# EAGLE design kbd2snes (EAGLE 6.6.0)
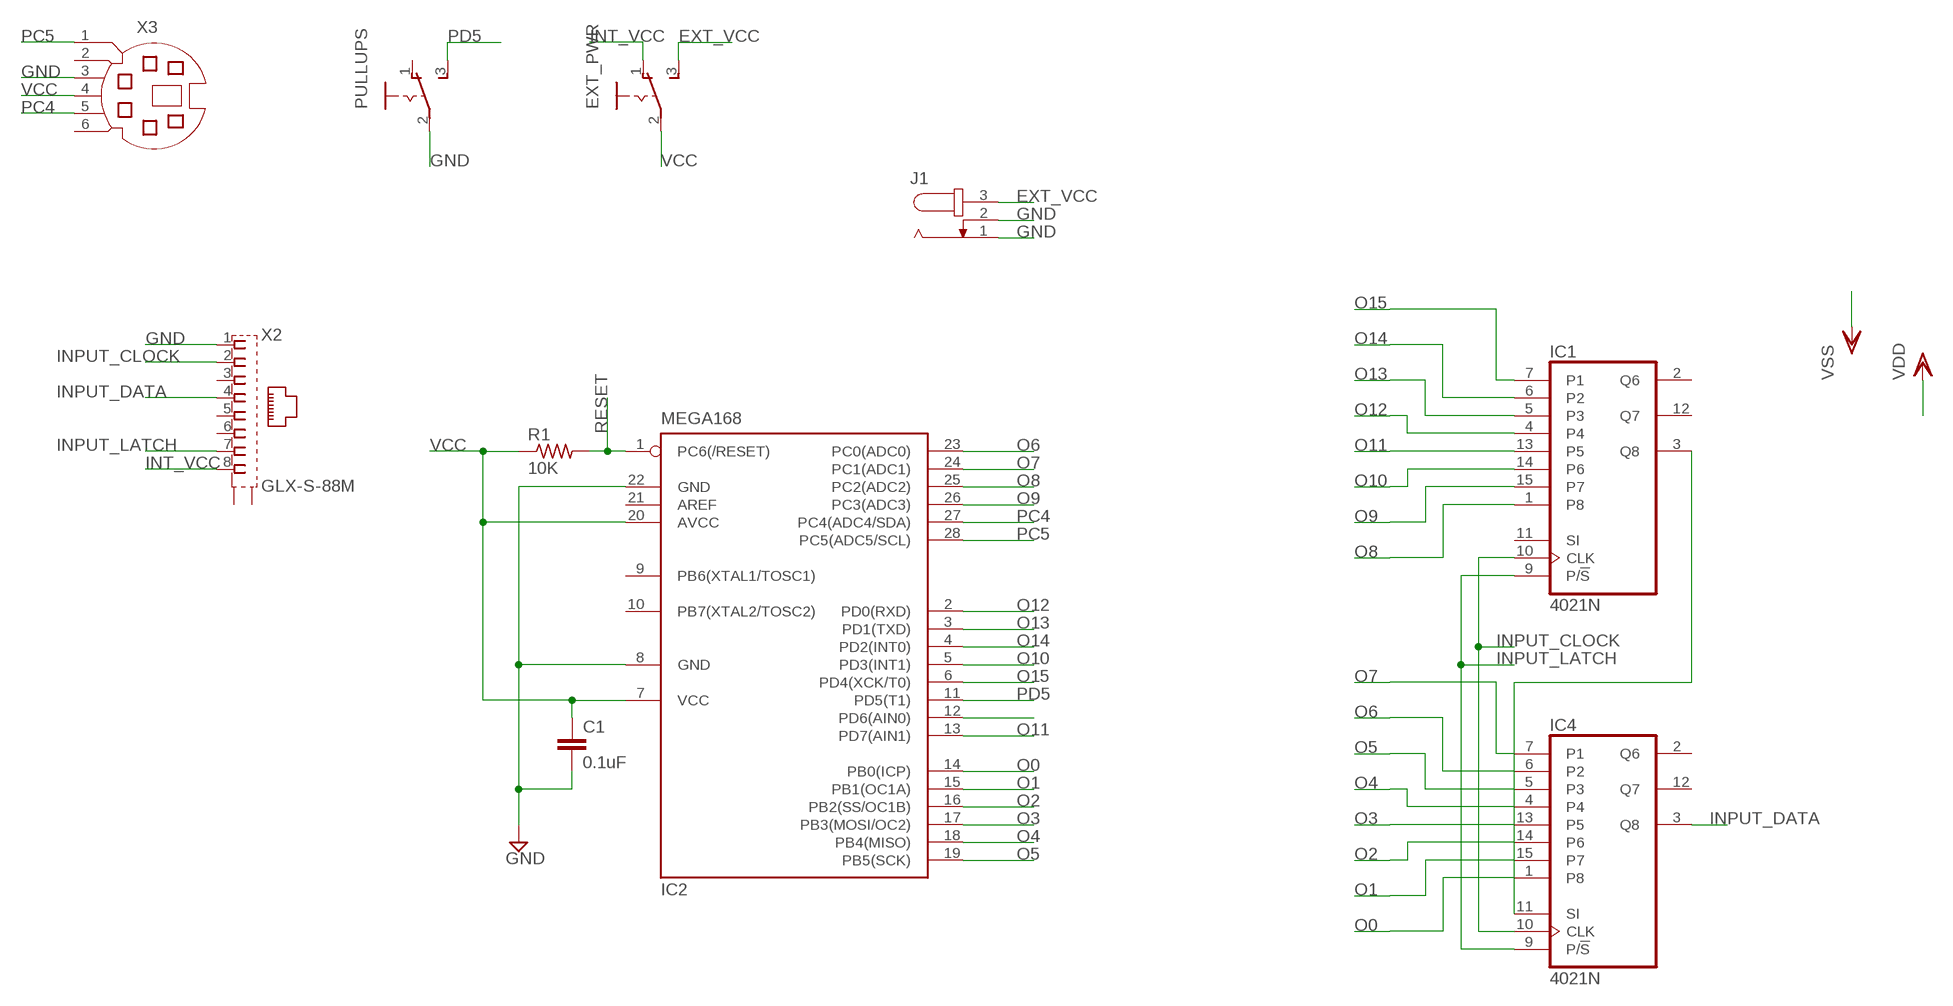
[diagram p0: schematic, sheet 1]

## Parts
C1  0.1uF  C-EU050-024X044  [C050-024X044]
EXT_PWR  CHAVE  [CHAVE]
IC1  4021N  [DIL16]
IC2  MEGA168  MEGA8-P  [DIL28-3]
IC4  4021N  [DIL16]
J1  JACK-PLUG1  [SPC4078]
PULLUPS  CHAVE  [CHAVE]
R1  10K  R-US_0207/7  [0207/7]
X2  GLX-S-88M  [GLX-S-88M]
X3  MD06SS  [MDIN06SS]

## Nets
EXT_VCC: EXT_PWR.3(S) J1.3
GND: C1.2 IC2.8(GND) IC2.22(GND) J1.1 J1.2 PULLUPS.2(P) X2.1 X3.3 ; supply symbol labelled VSS
INPUT_CLOCK: IC1.10(CLK) IC4.10(CLK) X2.2
INPUT_DATA: IC4.3(Q8) X2.4
INPUT_LATCH: IC1.9(P/!S) IC4.9(P/!S) X2.7
INT_VCC: EXT_PWR.1(O) X2.8
N$2: IC1.3(Q8) IC4.11(SI)
N$12: IC2.12(PD6(AIN0))
O0: IC2.14(PB0(ICP)) IC4.1(P8)
O1: IC2.15(PB1(OC1A)) IC4.15(P7)
O2: IC2.16(PB2(SS/OC1B)) IC4.14(P6)
O3: IC2.17(PB3(MOSI/OC2)) IC4.13(P5)
O4: IC2.18(PB4(MISO)) IC4.4
O5: IC2.19(PB5(SCK)) IC4.5(P3)
O6: IC2.23(PC0(ADC0)) IC4.6(P2)
O7: IC2.24(PC1(ADC1)) IC4.7(P1)
O8: IC1.1(P8) IC2.25(PC2(ADC2))
O9: IC1.15(P7) IC2.26(PC3(ADC3))
O10: IC1.14(P6) IC2.5(PD3(INT1))
O11: IC1.13(P5) IC2.13(PD7(AIN1))
O12: IC1.4 IC2.2(PD0(RXD))
O13: IC1.5(P3) IC2.3(PD1(TXD))
O14: IC1.6(P2) IC2.4(PD2(INT0))
O15: IC1.7(P1) IC2.6(PD4(XCK/T0))
PC4: IC2.27(PC4(ADC4/SDA)) X3.5
PC5: IC2.28(PC5(ADC5/SCL)) X3.1
PD5: IC2.11(PD5(T1)) PULLUPS.3(S)
RESET: IC2.1(PC6(/RESET)) R1.2
VCC: C1.1 EXT_PWR.2(P) IC2.7(VCC) IC2.20(AVCC) R1.1 X3.4 ; supply symbol labelled VDD
Unconnected: IC1.2(Q6) IC1.11(SI) IC1.12(Q7) IC2.9(PB6(XTAL1/TOSC1)) IC2.10(PB7(XTAL2/TOSC2)) IC2.21(AREF) IC4.2(Q6) IC4.12(Q7) PULLUPS.1(O) X2.3 X2.5 X2.6 X2.S1 X2.S2 X3.2 X3.6

## Power pins joined to a net without a drawn wire
GND: IC1.8(VSS) IC4.8(VSS)
VCC: IC1.16(VDD) IC4.16(VDD)

## Library data of the parts
C1 = rcl:C-EU: CAPACITOR, European symbol
EXT_PWR PULLUPS = switch-fef:CHAVE: chave Verificar
IC1 IC4 = 40xx:4021: 8-bit static SHIFT REGISTER
IC2 = atmel:MEGA8-P: MICROCONTROLLER 8 Kbytes FLASH, 1 kbytes SRAM, 512 bytes EEPROM, USART, 4-channel 10 bit ADC, 2-channel 8 bit ADC Pin compatible with Atmega48, ATMega88, ATMega168 Source: avr.lbr; OC_FARNELL: unknown; OC_NEWARK: unknown
J1 = con-jack:JACK-PLUG: DC POWER JACK Power Jack, DC, Right Angle, Through Hole, Rated 5A at 16VDC, PC Terminals Distributor: Farnell (www.Farnell.de) Drawing: 84N1161.pdf / 84N1162.pdf Manufacturer: SPC Technology (www.spctechnology.com) Type: SPC4077 / SPC 4078; OC_FARNELL: unknown; OC_NEWARK: unknown
R1 = rcl:R-US_: RESISTOR, American symbol
X2 = con-kycon:GLX-S-88M: Mod. Jack, Right Angle, 8 posiotion, 8 contatcs RJ45 Source: GLX-S-88M.pdf; OC_FARNELL: unknown; OC_NEWARK: unknown
X3 = con-yamaichi:MD06SS: YAMAICHI CONNECTOR; OC_FARNELL: unknown; OC_NEWARK: unknown

## Board
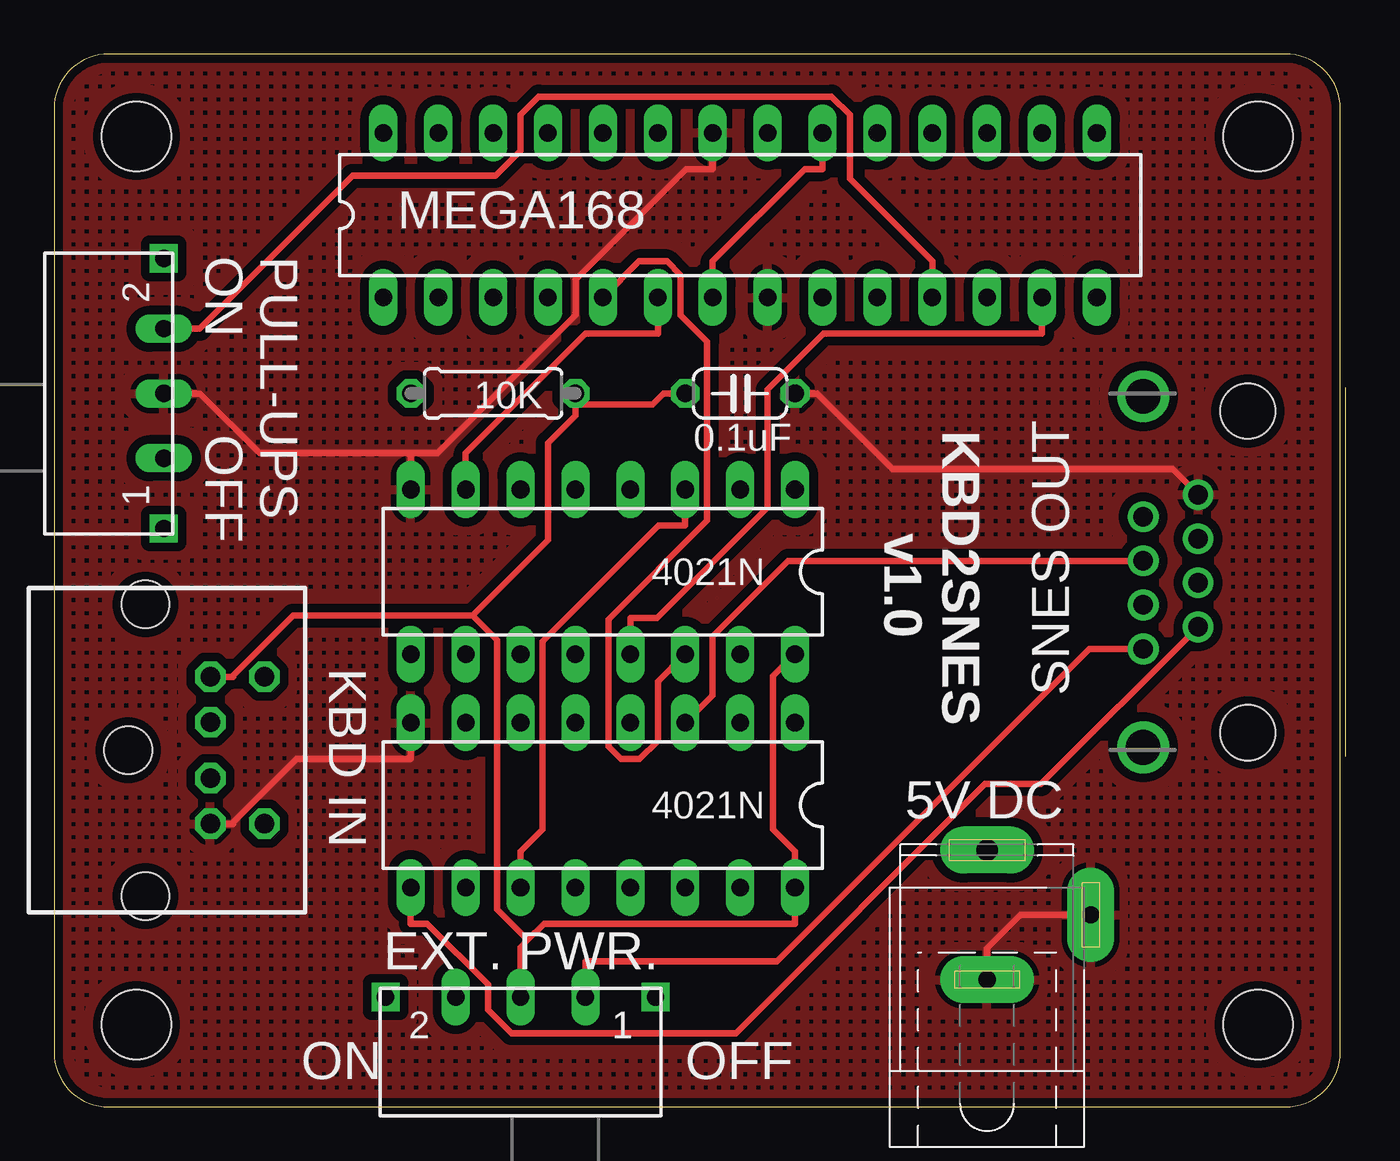
[diagram p1: board, top side]
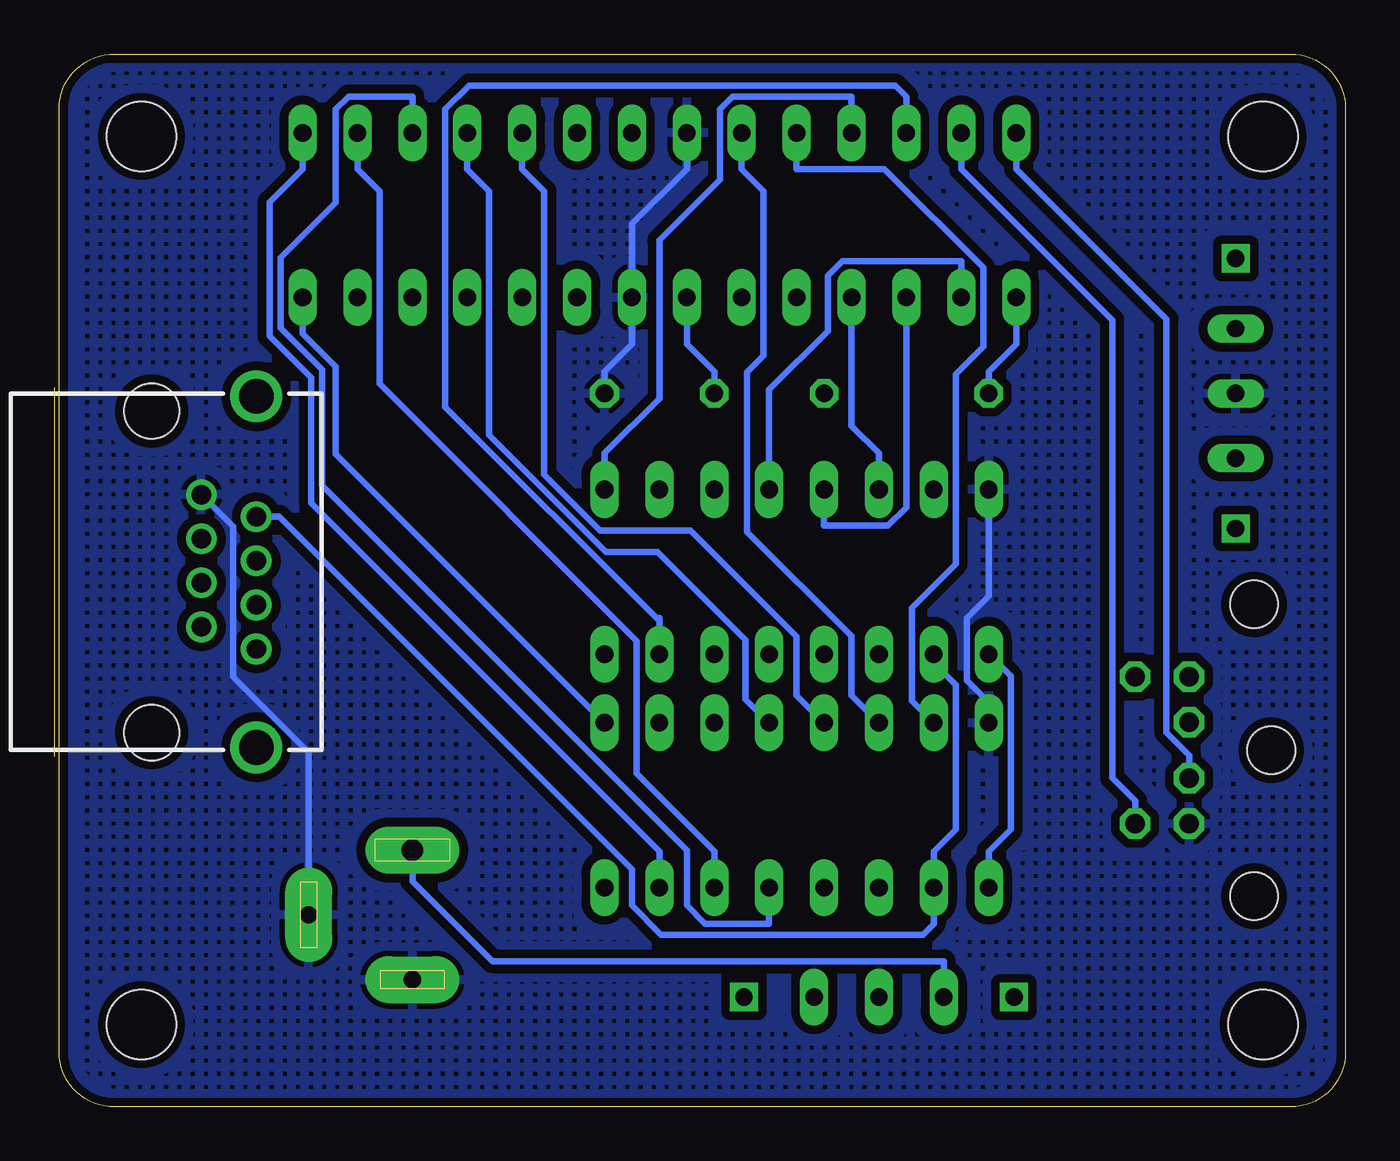
[diagram p2: board, bottom side, seen from below]

Size 59.52 x 48.73 mm. Coordinates in mm from the lower left corner, seen from the top.
Outline: 0,46.19 0,2.54 arc90 2.54,0 56.98,0 arc90 59.52,2.54 59.52,46.19 arc90 56.98,48.73 2.54,48.73 arc90 0,46.19
Copper layers (1*16): Top 0.035mm / dielectric 1.5mm / Bottom 0.035mm
Design rules "SeeedStudio_2layer_DRU_no_angle_20140221": minimum track width 6mil, minimum drill 12mil, track to track 6mil, track to pad 6mil, pad to pad 6mil, via to via 6mil, smd to smd 0mil, copper to edge 10mil, drill to drill 10mil, minimum pad ring 10mil, minimum via ring 6mil, stop-mask expansion 2mil, vias tented up to drill 100mil, thermal gap 10mil
Holes 3.2 mm at 3.81,3.81 55.72,3.81 3.81,44.92 55.72,44.92

### Footprints (pad centres in the part's own frame; a part is rotated, then mirrored left to right if it is on the bottom)
C050-024X044 = drill 0.813 octagon: 1 -2.54,0; 2 2.54,0
CHAVE = drill 0.8 long: 1 -3,0; 2 0,0; 3 3,0 | drill 0.8 square: P$1 -6.25,0; P$2 6.25,0
DIL16 = drill 0.813 long: 1 -8.89,-3.81; 2 -6.35,-3.81; 3 -3.81,-3.81; 4 -1.27,-3.81; 5 1.27,-3.81; 6 3.81,-3.81; 7 6.35,-3.81; 8 8.89,-3.81; 9 8.89,3.81; 10 6.35,3.81; 11 3.81,3.81; 12 1.27,3.81; 13 -1.27,3.81; 14 -3.81,3.81; 15 -6.35,3.81; 16 -8.89,3.81
DIL28-3 = drill 0.813 long: 1 -16.51,-3.81; 2 -13.97,-3.81; 3 -11.43,-3.81; 4 -8.89,-3.81; 5 -6.35,-3.81; 6 -3.81,-3.81; 7 -1.27,-3.81; 8 1.27,-3.81; 9 3.81,-3.81; 10 6.35,-3.81; 11 8.89,-3.81; 12 11.43,-3.81; 13 13.97,-3.81; 14 16.51,-3.81; 15 16.51,3.81; 16 13.97,3.81; 17 11.43,3.81; 18 8.89,3.81; 19 6.35,3.81; 20 3.81,3.81; 21 1.27,3.81; 22 -1.27,3.81; 23 -3.81,3.81; 24 -6.35,3.81; 25 -8.89,3.81; 26 -11.43,3.81; 27 -13.97,3.81; 28 -16.51,3.81
SPC4078 = drill 0.8 pad 2.184 long: 1 -3,0; 2 0,-4.8 | drill 1 pad 2.184 long: 3 3,0
0207/7 = drill 0.813 octagon: 1 -3.81,0; 2 3.81,0
GLX-S-88M = drill 0.9 pad 1.422: 1 -3.57,-2.3; 2 -2.55,-4.84; 3 -1.53,-2.3; 4 -0.51,-4.84; 5 0.51,-2.3; 6 1.53,-4.84; 7 2.55,-2.3; 8 3.57,-4.84 | drill 1.6 pad 2.184: S1 -8.125,-4.84; S2 8.125,-4.84 | hole 2.55: -7.44,0; 7.44,0
MDIN06SS = drill 0.9 octagon: 1 1.3,8.5; 2 -1.3,8.5; 3 3.4,8.5; 4 -3.4,8.5; 5 3.4,11; 6 -3.4,11 | hole 2.2: -6.75,5.5; 0,4.7; 6.75,5.5

### Placement (x,y rotation side)
C1  31.75,33.02 0 top
EXT_PWR  21.59,5.08 180 top
IC1  25.4,24.77 180 top
IC2  31.75,41.27 0 top
IC4  25.4,13.97 180 top
J1  43.18,8.89 90 top
PULLUPS  5.08,33.02 90 top
R1  20.32,33.02 180 top
X2  55.24,24.77 270 top
X3  -1.27,16.51 270 top

### Tracks (layer width: path | path; a pad name or v marks a point on that pad's centre or on a via)
EXT_VCC
  Bottom 0.305: EXT_PWR.3 18.59,6.74 39.48,6.74 43.18,10.44 43.18,11.79 | 43.18,11.79 J1.3 43.28,11.79 43.18,11.79 | EXT_PWR.3 18.69,5.08 EXT_PWR.3 | EXT_PWR.3
GND
  Top 0.305: IC4.8 16.51,16.1 11.22,16.1 8.29,13.18 8.29,13.11 7.32,13.11 | 7.32,13.11 X3.3 7.32,13.21 7.32,13.11 | C1.2 35.31,33.02 38.81,29.52 51.77,29.52 X2.1 | IC2.22 30.48,43.41 29.24,43.41 24.13,38.3 24.13,36.64 17.74,30.25 16.51,30.25 | PULLUPS.2 6.74,33.02 9.51,30.25 16.51,30.25 | IC1.8 16.51,30.25 | J1.1 43.28,5.89 J1.1 | J1.1 43.18,7.34 44.73,8.89 47.95,8.89 | 47.95,8.89 J1.2 47.95,8.94 47.95,8.89
  Bottom 0.305: IC4.8 16.51,18.73 17.53,19.75 17.53,22.63 16.51,23.65 IC1.8 | IC2.22 30.48,43.41 33.02,40.87 IC2.8 33.02,35.31 34.29,34.04 C1.2 | 47.98,8.94 J1.2 47.95,8.94 47.98,8.94 | 47.98,8.94 47.98,16.41 51.47,19.91 51.47,26.86 X2.1
  pour Bottom (isolate 0.406, hatched): 0,49.53 59.69,49.53 59.69,0 0,0
  pour Top (isolate 0.406, hatched): 0,49.53 59.69,49.53 59.69,0 0,0
INPUT_CLOCK
  Bottom 0.305: 50.39,27.32 X2.2 50.39,27.43 50.39,27.32 | 50.39,27.32 49.34,27.32 33.02,10.99 33.02,9.32 31.67,7.97 19.56,7.97 19.05,8.48 IC4.10 19.05,11.84 18.03,12.85 18.03,19.54 19.05,20.55 IC1.10
INPUT_DATA
  Top 0.305: 50.39,25.27 X2.4 50.39,25.4 50.39,25.27 | 50.39,25.27 33.97,25.27 30.48,21.79 30.48,19.05 IC4.3
INPUT_LATCH
  Top 0.305: IC4.9 16.51,8.48 17.27,8.48 20.09,5.67 20.09,4.5 21.17,3.42 31.56,3.42 43.09,14.94 45.67,14.94 X2.7 | X2.7 53.03,22.15 X2.7
  Bottom 0.305: IC1.9 15.49,19.94 15.49,12.85 16.51,11.84 IC4.9
INT_VCC
  Top 0.305: X2.8 47.91,21.2 33.45,6.74 24.59,6.74 EXT_PWR.1 | EXT_PWR.1 | EXT_PWR.1
N$2
  Top 0.305: IC1.3 29.21,26.9 27.97,26.9 22.61,21.53 22.61,12.85 21.59,11.84 IC4.11
O0
  Bottom 0.305: IC4.1 46.74,30.23 46.74,34.27 48.26,35.79 IC2.14
O1
  Bottom 0.305: IC2.15 48.26,43.41 49.79,41.88 49.79,35.69 47.87,33.77 47.87,27.95 31.75,11.84 IC4.15
O2
  Bottom 0.305: IC2.16 45.72,43.41 44.7,42.39 44.7,33.47 32.8,21.56 32.8,15.43 29.21,11.84 IC4.14
O3
  Bottom 0.305: IC4.13 26.67,8.48 29.63,8.48 30.48,9.33 30.48,11.87 47.36,28.75 47.36,34.13 49.28,36.05 49.28,39.31 46.74,41.86 46.74,46.17 46.14,46.76 43.18,46.76 IC2.17
O4
  Bottom 0.305: IC4.4 27.76,18.87 27.76,21.61 31.83,25.68 34.21,25.68 39.62,31.09 39.62,42.39 40.64,43.41 IC2.18
O5
  Bottom 0.305: IC2.19 38.1,43.41 37.08,42.39 37.08,29.27 34.5,26.69 30.3,26.69 25.4,21.78 25.4,19.05 IC4.5
O6
  Bottom 0.305: IC4.6 22.86,19.05 22.86,21.79 27.69,26.62 27.69,34 26.92,34.77 26.92,42.39 27.94,43.41 IC2.23
O7
  Bottom 0.305: IC4.7 20.07,18.8 20.07,23.09 18.03,25.13 18.03,33.92 16.76,35.19 16.76,38.84 21.33,43.41 25.4,43.41 IC2.24
O8
  Bottom 0.305: IC1.1 34.29,30.25 31.75,32.79 31.75,40.11 28.96,42.9 28.96,46.17 28.36,46.76 22.86,46.76 IC2.25
O9
  Bottom 0.305: IC1.15 31.75,22.63 31.89,22.63 41.66,32.4 41.66,46.17 40.55,47.27 20.83,47.27 20.32,46.76 IC2.26
O10
  Top 0.305: IC1.14 27.94,19.68 27.94,16.95 27.09,16.1 26.25,16.1 25.65,16.7 25.65,22.55 30.23,27.13 30.23,35.43 29,36.66 29,38.5 28.36,39.14 27.08,39.14 IC2.5
O11
  Top 0.305: IC1.13 26.67,22.63 27.91,22.63 33.02,27.74 33.02,33.2 35.61,35.79 45.72,35.79 IC2.13
O12
  Bottom 0.305: IC2.2 17.78,39.14 23.28,39.14 23.95,38.47 23.95,35.91 26.67,33.19 IC1.4
O13
  Bottom 0.305: IC1.5 24.13,26.9 21.17,26.9 20.32,27.75 IC2.3
O14
  Bottom 0.305: IC1.6 21.59,30.25 22.86,31.52 IC2.4
O15
  Top 0.305: IC1.7 19.05,30.25 24.59,35.79 27.94,35.79 IC2.6
PC4
  Bottom 0.305: IC2.27 17.78,43.41 10.79,36.42 10.79,15.23 9.73,14.17 9.73,13.21 | 9.73,13.21 X3.5 9.75,13.21 9.73,13.21
PC5
  Bottom 0.305: IC2.28 15.24,43.41 8.29,36.46 8.29,17.33 7.23,16.27 7.23,15.24 | 7.23,15.24 X3.1 7.32,15.24 7.23,15.24
PD5
  Top 0.305: IC2.11 40.64,39.14 36.83,42.95 36.83,45.92 35.99,46.76 22.43,46.76 21.59,45.92 21.59,44.26 20.43,43.09 13.82,43.09 6.74,36.02 PULLUPS.3 | PULLUPS.3 5.08,35.97 PULLUPS.3 | PULLUPS.3
RESET
  Bottom 0.305: R1.2 16.51,34.04 15.24,35.31 IC2.1
VCC
  Top 0.305: IC2.20 35.56,43.41 34.75,43.41 30.48,39.14 IC2.7 | C1.1 28.19,33.02 27.69,32.51 24.13,32.51 | 24.13,32.51 24.13,32 22.86,30.73 22.86,26.24 19.36,22.74 | R1.1 24.13,32.51 | 19.36,22.74 20.5,21.61 20.5,9.15 21.92,7.72 | 19.36,22.74 11.06,22.74 8.29,19.98 8.29,19.91 7.32,19.91 | 21.92,7.72 21.59,7.39 21.59,6.74 EXT_PWR.2 | 21.92,7.72 22.68,8.48 34.29,8.48 IC4.16 34.29,10.56 34.29,11.84 33.27,12.85 33.27,19.94 IC1.16 | 7.32,19.91 X3.4 7.32,19.91
  Bottom 0.305: C1.1 29.21,34.04 30.48,35.31 IC2.7

### Text on the board
tPlace: ON | PULL-UPS | OFF | KBD2SNES / v1.0 | KBD IN | SNES OUT | 5V DC | EXT. PWR. | ON | OFF